# EAGLE schematic Circuito_lm386 (EAGLE 9.6.2)
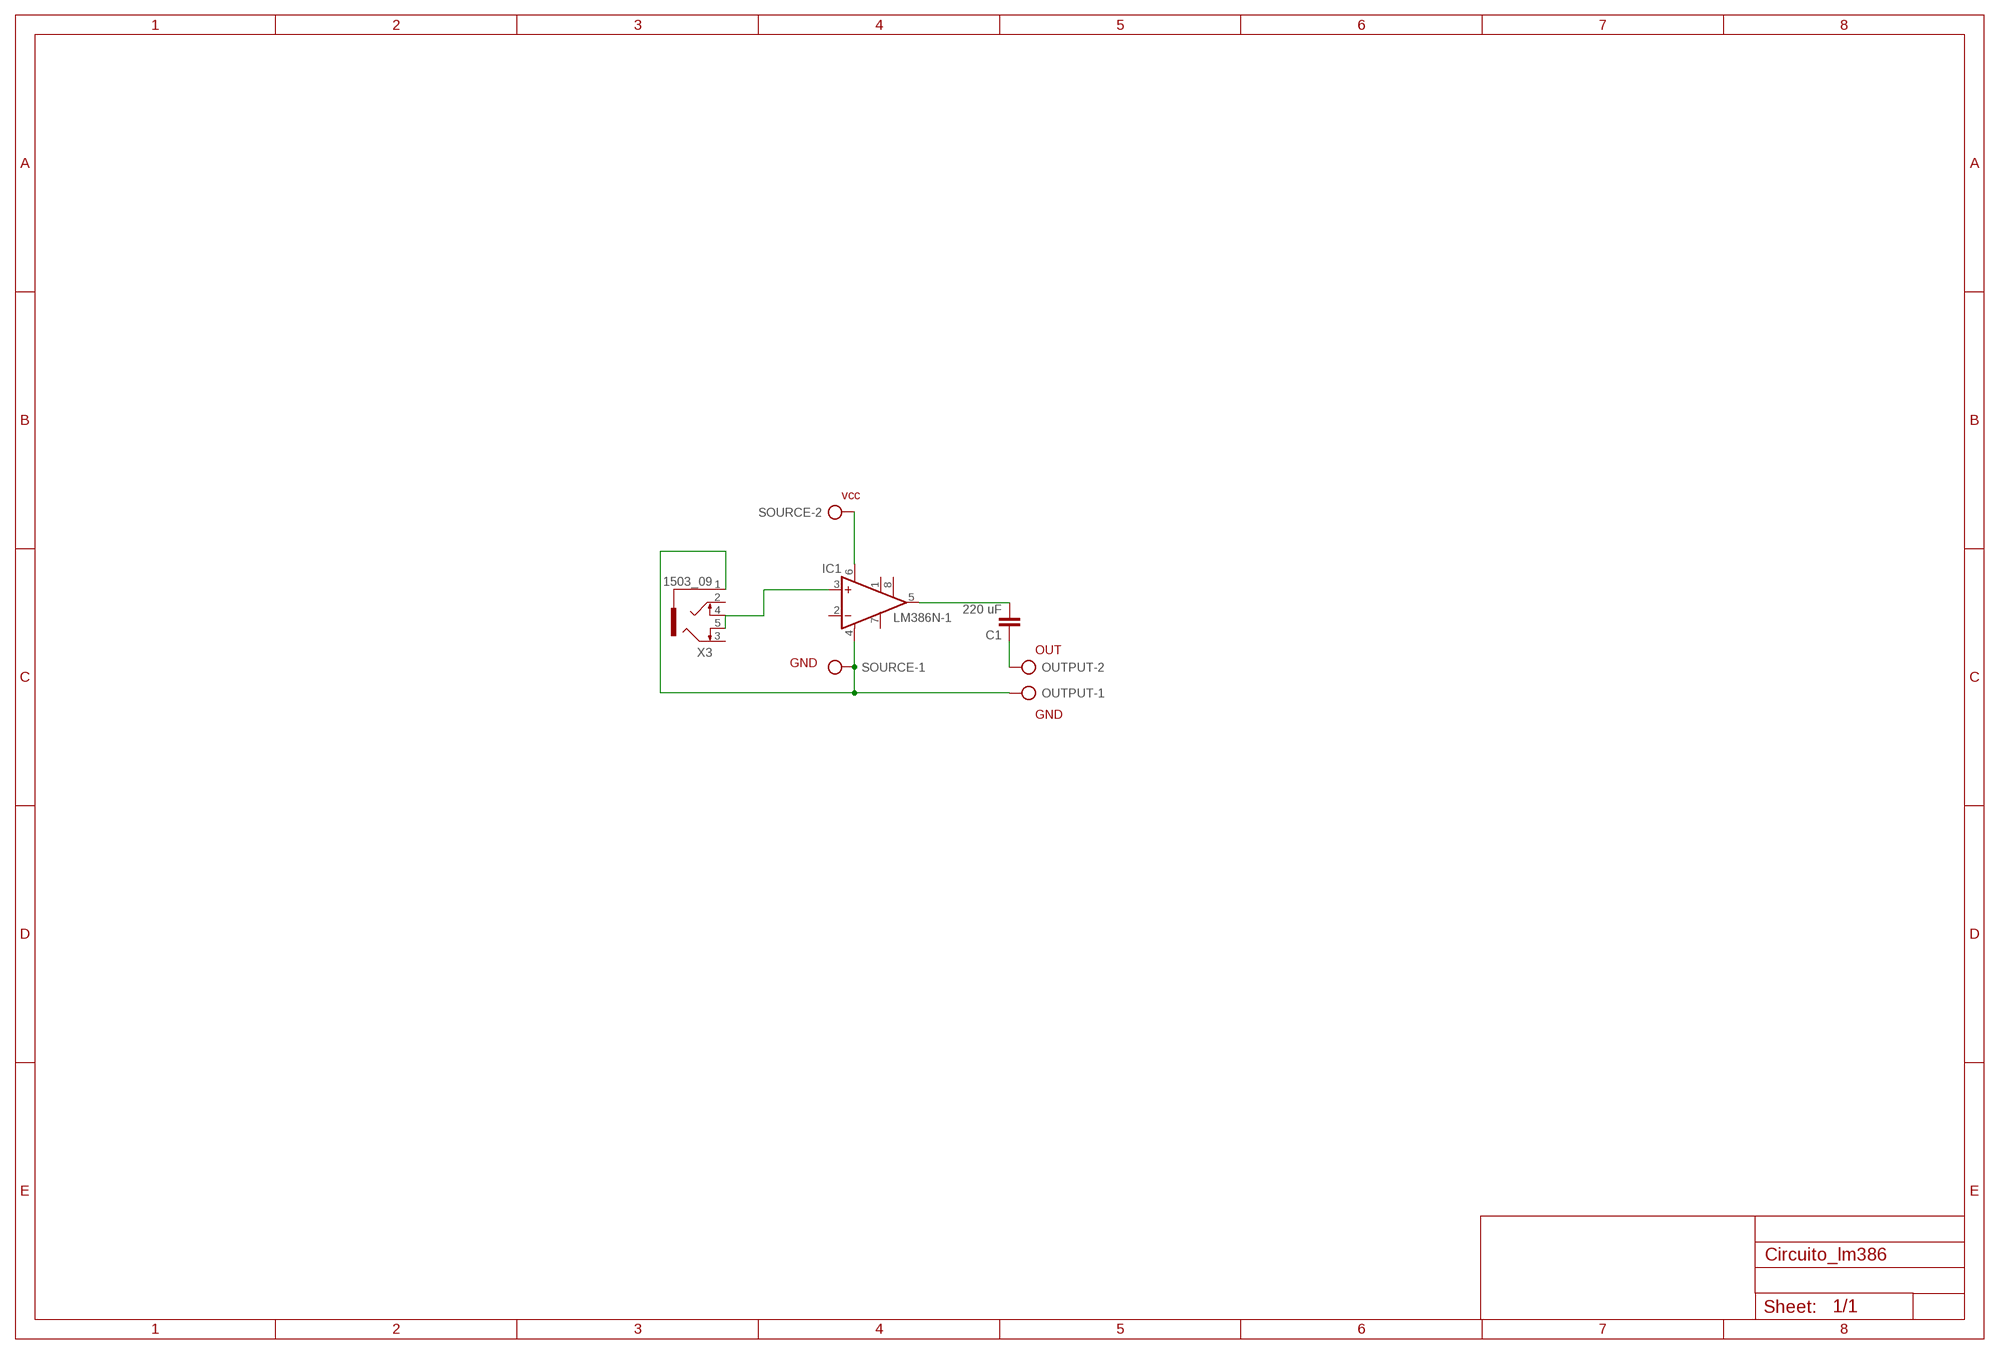
[diagram p0: schematic, sheet 1]

## Parts
C1  220 uF  C5/3  [C5B3]
IC1  LM386N-1  [DIL08]
OUTPUT  AK500/2-H  [AK500/2-H]
SOURCE  AK500/2-H  [AK500/2-H]
X3  1503_09  [1503_09]

## Nets
N$1: IC1.3(+IN) X3.4 X3.5
N$2: IC1.6(VS) SOURCE.2
N$3: IC1.4(GND) OUTPUT.1 SOURCE.1 X3.1
N$4: C1.2 IC1.5(OUT)
N$5: C1.1 OUTPUT.2
Unconnected: IC1.1(GAIN) IC1.2(-IN) IC1.7(BYPASS) IC1.8(GAIN) X3.2 X3.3

## Notes on the sheet
- vcc
- OUT
- GND
- GND

## Library data of the parts
C1 = capacitor-wima:C: CAPACITOR naming: grid - package width
IC1 = linear:LM386?-*: Low Voltage Audio Power Amplifier Source: http://cache.national.com/ds/LM/LM386.pdf
OUTPUT SOURCE = con-ptr500:AK500/2-H: CONNECTOR Aug. 2004 / PTR Meßtechnik: Die Bezeichnung der Serie AK505 wurde geändert. Es handelt sich hierbei um AK500 in horizontaler Ausführung.; OC_FARNELL: unknown; OC_NEWARK: unknown
X3 = con-lumberg:1503_09: Jack connectors according to JISC 6560, 3.5 mm Klinkeneinbaukupplung nach JISC 6560, 3,5 mm, 3-polig/ stereo, abgewinkelte Ausführung, mit 2 Öffnern und Lötaugen, für Leiterplatten Rückseitenmontage Source: http://www.lumberg.com/Produkte/PDFs/1503_09.pdf; OC_FARNELL: 1243244; OC_NEWARK: unknown